# Altium schematic sheet Statron_RP2040.SchDoc
size A4; SheetNumber: 1; SheetTotal: 1
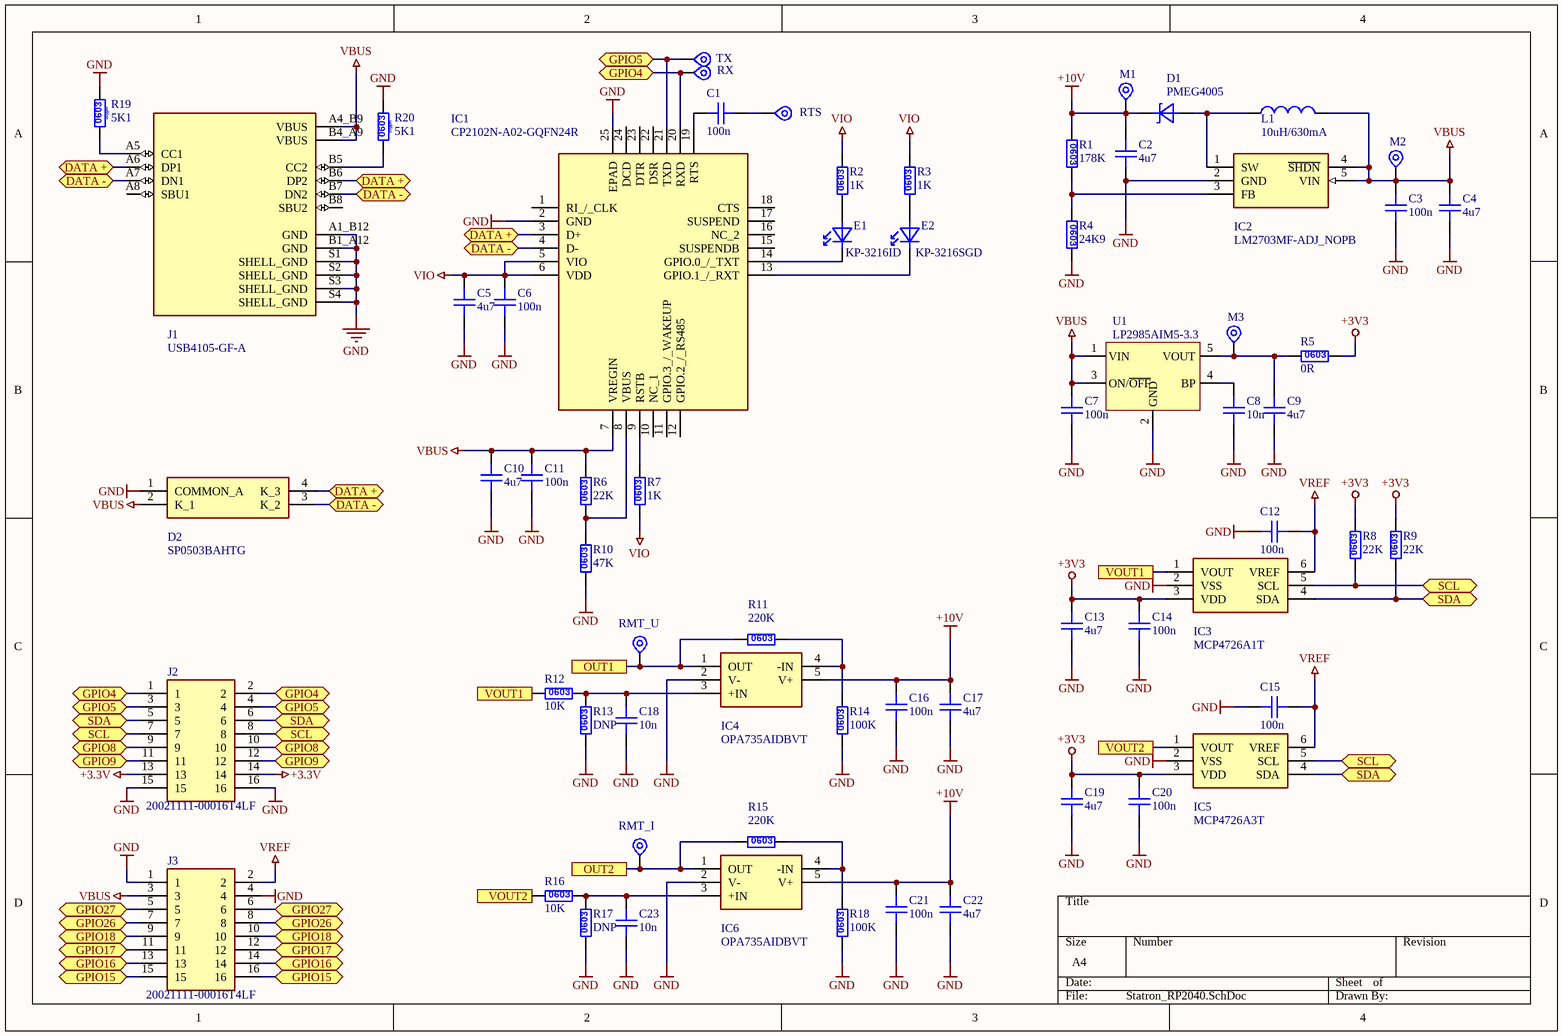
[diagram p0: Statron_RP2040.SchDoc]

## Parts
C1  100n  [C0603M]
C2  4u7  [C0603]
C3  100n  [C0603M]
C4  4u7  [C0603]
C5  4u7  [C0603]
C6  100n  [C0603M]
C7  100n  [C0603M]
C8  10n  [C0603M]
C9  4u7  [C0603]
C10  4u7  [C0603]
C11  100n  [C0603M]
C12  100n  [C0603M]
C13  4u7  [C0603]
C14  100n  [C0603M]
C15  100n  [C0603M]
C16  100n  [C0603M]
C17  4u7  [C0603]
C18  10n  [C0603M]
C19  4u7  [C0603]
C20  100n  [C0603M]
C21  100n  [C0603M]
C22  4u7  [C0603]
C23  10n  [C0603M]
D1  PMEG4005  [SOD323]
D2  SP0503BAHTG  [SP0503BAHTG]
E1  KP-3216ID  [LED1206 R]
E2  KP-3216SGD  [LED1206 G]
IC1  CP2102N-A02-GQFN24R  [QFN50P400X400X80-25N-D]
IC2  LM2703MF-ADJ_NOPB  [SOT95P280X145-5N]
IC3  MCP4726A1T  [SOT95P270X145-6N]
IC4  OPA735AIDBVT  [SOT95P280X145-5N]
IC5  MCP4726A3T  [SOT95P270X145-6N]
IC6  OPA735AIDBVT  [SOT95P280X145-5N]
J1  USB4105-GF-A  [GCT_USB4105-GF-A]
J2  20021111-00016T4LF  [2002111100016T4LF]
J3  20021111-00016T4LF  [2002111100016T4LF]
L1  10uH/630mA  [L_HEXAGON_2.8x2.8_H1.3_SMD_WE-TPC_2813]
M1  TP  [Pad 1mm SMD]  (value not drawn)  (no BOM)
M2  TP  [Pad 1mm SMD]  (value not drawn)  (no BOM)
M3  TP  [Pad 1mm SMD]  (value not drawn)  (no BOM)
R1  178K  [R0603]
R2  1K  [R0603]
R3  1K  [R0603]
R4  24K9  [R0603]
R5  0R  [R0603]
R6  22K  [R0603]
R7  1K  [R0603]
R8  22K  [R0603]
R9  22K  [R0603]
R10  47K  [R0603]
R11  220K  [R0603]
R12  10K  [R0603]
R13  DNP  [R0603]
R14  100K  [R0603]
R15  220K  [R0603]
R16  10K  [R0603]
R17  DNP  [R0603]
R18  100K  [R0603]
R19  5K1  [R0603]
R20  5K1  [R0603]
RMT_I  TP  [Pad0.6mm]  (value not drawn)  (no BOM)
RMT_U  TP  [Pad0.6mm]  (value not drawn)  (no BOM)
RTS  TP  [Pad0.6mm]  (value not drawn)  (no BOM)
RX  TP  [Pad0.6mm]  (value not drawn)  (no BOM)
TX  TP  [Pad0.6mm]  (value not drawn)  (no BOM)
U1  LP2985AIM5-3.3  [SOT23-5]

## Ports
DATA + (bidir), DATA - (bidir), GPIO4 (bidir), GPIO5 (bidir), GPIO8 (bidir), GPIO9 (bidir), GPIO15 (bidir), GPIO16 (bidir), GPIO17 (bidir), GPIO18 (bidir), GPIO26 (bidir), GPIO27 (bidir), OUT1, OUT2, SCL (bidir), SDA (bidir), VOUT1, VOUT2

## Nets
+3.3V: J2.13 J2.14
+3V3: C13.2 C14.2 C19.2 C20.2 IC3.3(VDD) IC5.3(VDD) R5.1 R8.1 R9.1
+10V: C2.2 C16.1 C17.2 C21.1 C22.2 D1.2(C) IC4.5(V+) IC6.5(V+) M1.1 R1.2
GND: C2.1 C3.2 C4.2 C5.2 C6.2 C7.2 C8.2 C9.2 C10.2 C11.2 C12.2 C13.1 C14.1 C15.2 C16.2 C17.1 C18.2 C19.1 C20.1 C21.2 C22.1 C23.2 D2.1(COMMON_A) IC1.2(GND) IC1.25(EPAD) IC2.2(GND) IC3.2(VSS) IC4.2(V-) IC5.2(VSS) IC6.2(V-) J1.A1_B12(GND) J1.B1_A12(GND) J1.S1(SHELL_GND) J1.S2(SHELL_GND) J1.S3(SHELL_GND) J1.S4(SHELL_GND) J2.15 J2.16 J3.1 J3.4 R4.1 R10.2 R13.2 R14.2 R17.2 R18.2 R19.1 R20.1 U1.2(GND)
VBUS: C3.1 C4.1 C7.1 C10.1 C11.1 D2.2(K_1) IC1.7(VREGIN) IC2.4(~{SHDN}) IC2.5(VIN) J1.A4_B9(VBUS) J1.B4_A9(VBUS) J3.3 L1.2 M2.1 R6.1 U1.1(VIN) U1.3(ON/~{OFF})
VIO: C5.1 C6.1 IC1.5(VIO) IC1.6(VDD) R2.1 R3.1 R7.2
VREF: C12.1 C15.1 IC3.6(VREF) IC5.6(VREF) J3.2
DATA +: D2.4(K_3) IC1.3(D+) J1.A6(DP1) J1.B6(DP2) ; port DATA +
DATA -: D2.3(K_2) IC1.4(D-) J1.A7(DN1) J1.B7(DN2) ; port DATA -
GPIO4: IC1.20(RXD) J2.1 J2.2 RX.1 ; port GPIO4
GPIO5: IC1.21(TXD) J2.3 J2.4 TX.1 ; port GPIO5
GPIO8: J2.9 J2.10 ; port GPIO8
GPIO9: J2.11 J2.12 ; port GPIO9
GPIO15: J3.15 J3.16 ; port GPIO15
GPIO16: J3.13 J3.14 ; port GPIO16
GPIO17: J3.11 J3.12 ; port GPIO17
GPIO18: J3.9 J3.10 ; port GPIO18
GPIO26: J3.7 J3.8 ; port GPIO26
GPIO27: J3.5 J3.6 ; port GPIO27
OUT1: IC4.1(OUT) R11.2 RMT_U.1 ; port OUT1
OUT2: IC6.1(OUT) R15.2 RMT_I.1 ; port OUT2
SCL: IC3.5(SCL) IC5.5(SCL) J2.7 J2.8 R8.2 ; port SCL
SDA: IC3.4(SDA) IC5.4(SDA) J2.5 J2.6 R9.2 ; port SDA
VOUT1: IC3.1(VOUT) R12.2 ; port VOUT1
VOUT2: IC5.1(VOUT) R16.2 ; port VOUT2
NetC1_1: C1.1 RTS.1
NetC1_2: C1.2 IC1.19(RTS)
NetC8_1: C8.1 U1.4(BP)
NetC9_1: C9.1 M3.1 R5.2 U1.5(VOUT)
NetC18_1: C18.1 IC4.3(+IN) R12.1 R13.1
NetC23_1: C23.1 IC6.3(+IN) R16.1 R17.1
NetD1_1: D1.1(A) IC2.1(SW) L1.1
NetE1_1: E1.1(A) R2.2
NetE1_2: E1.2(C) IC1.14(GPIO.0_/_TXT)
NetE2_1: E2.1(A) R3.2
NetE2_2: E2.2(C) IC1.13(GPIO.1_/_RXT)
NetIC1_8: IC1.8(VBUS) R6.2 R10.1
NetIC1_9: IC1.9(RSTB) R7.1
NetIC2_3: IC2.3(FB) R1.1 R4.2
NetIC4_4: IC4.4(-IN) R11.1 R14.1
NetIC6_4: IC6.4(-IN) R15.1 R18.1
NetJ1_A5: J1.A5(CC1) R19.2
NetJ1_B5: J1.B5(CC2) R20.2

Not connected (* = marked no-connect by the designer): IC1 1(RI_/_CLK) 10(NC_1) 11(GPIO.3_/_WAKEUP) 12(GPIO.2_/_RS485) 15(SUSPENDB) 16(NC_2) 17(SUSPEND) 18(CTS) 22(DSR) 23(DTR) 24(DCD); J1 A8(SBU1) B8(SBU2)

## Notes on the sheet
- (in symbol CMP-UN-001948-2) 50ppm; 0603
- (in symbol CMP-UN-001953-2) 0603
- (in symbol CMP-UN-001963-2) 0603
- (in symbol CMP-UN-001972-2) 0603
- (in symbol CMP-UN-001976-2) 0603
- (in symbol CMP-UN-001981-2) 0603
- (in symbol CMP-UN-002024-2) 0603
- (in symbol CMP-UN-002043-2) 0603

## Library data of the parts
C1 C3 C6 C11 C12 C14-C16 C20 C21 = CMP-UN-000268-1: Ceramic Capacitor X7R; Manufacturer: VISHAY; Part Number: 100n/16V X7R C0603; Main: Capacitors; SMD/THD: SMD; Value: 100n/16V; Stock number: 10003450; Category: Capacitors CERA SMD; Status: X; Manufacturer Part Number: 100n/16V X7R C0603; Component Type: Capacitors
C2 C4 C5 C9 C10 C13 C17 C19 C22 = CMP-UN-000401-1: Ceramic Capacitor X5R; Part Number: GRM188R60J475KE19J; Manufacturer: Murata; Value: 4u7/6,3V; SMD/THD: SMD; Main: Capacitors; Category: Capacitors CERA SMD; Stock number: 10006168; Status: T; ComponentLink1URL: http://datasheet.octopart.com/GRM188R60J475KE19J-Murata-datasheet-14401031.pdf; ComponentLink1Description: Datasheet; Manufacturer Part Number: GRM188R60J475KE19J; Component Type: Capacitors
C7 = UniversalCapacitor: Ceramic Capacitor X7R; Manufacturer: VISHAY; Part Number: 100n/16V X7R C0603; Main: Capacitors; SMD/THD: SMD; Value: 100n/16V; Stock number: 10003450; Category: Capacitors CERA SMD; Status: X
C8 C18 C23 = UniversalCapacitor: Ceramic Capacitor X7R; Manufacturer: VISHAY; Part Number: 10n/50V X7R C0603; SMD/THD: SMD; Main: Capacitors; Status: A; Stock number: 10002497; Category: Capacitors CERA SMD; Value: 10n
D1 = CMP-UN-000984-1: Schottky Diode 40V, 500mA; Part Number: PMEG4005AEA; Manufacturer: NXP; SMD/THD: SMD; Main: Diodes; ComponentLink1URL: http://www.farnell.com/datasheets/684565.pdf; Value: PMEG4005; ComponentLink1Description: Datasheet; Category: Schottky; Status: A; Stock number: 10004763
D2 = SP0503BAHTG: TVS Diode (Uni-directional); Manufacturer_Name: LITTELFUSE; Height: 1.22mm; Manufacturer_Part_Number: SP0503BAHTG
E1 = CMP-UN-001017-1: SMD LED Red; Manufacturer: KINGBRIGHT; Main: Diodes; ComponentLink1Description: Datasheet; Category: LED; ComponentLink1URL: http://www.tme.eu/en/details/kp-3216id/smd-leds-1206/kingbright-electronic/; Status: A; Part Number: KP-3216ID; Stock number: 10005421; SMD/THD: SMD; Value: Red
E2 = CMP-UN-001018-1: SMD LED Green; Manufacturer: KINGBRIGHT; Main: Diodes; Status: A; Value: Green; Part Number: KP-3216SGD; Category: LED; ComponentLink1URL: http://www.tme.eu/en/details/kp-3216sgd/smd-leds-1206/kingbright-electronic/; ComponentLink1Description: Datasheet; SMD/THD: SMD; Stock number: 10005422
IC1 = CP2102N-A02-GQFN24R: Integrated Circuit; Manufacturer_Name: Silicon Labs; Datasheet Link: https://componentsearchengine.com//CP2102N-A02-GQFN24R.pdf; Height: 0.8mm; Mouser2 Part Number: 634-CP2102NA02QFN24R; Mouser2 Price/Stock: https://www.mouser.com/Search/Refine.aspx?Keyword=634-CP2102NA02QFN24R; Manufacturer_Part_Number: CP2102N-A02-GQFN24R
IC2 = LM2703MF-ADJ_NOPB: Integrated Circuit; Manufacturer_Name: Texas Instruments; Manufacturer_Part_Number: LM2703MF-ADJ/NOPB; Datasheet Link: https://datasheet.datasheetarchive.com/originals/distributors/Datasheets-SFU2/DSASFU100036636.pdf; Height: 1.45mm
IC3 IC5 = MCP4726A3T-E_CH: Integrated Circuit; Manufacturer_Name: Microchip; Manufacturer_Part_Number: MCP4726A3T-E/CH; Datasheet Link: https://componentsearchengine.com//MCP4726A3T-E_CH.pdf; Height: 1.45mm; Mouser2 Part Number: 579-MCP4726A3TECH; Mouser2 Price/Stock: https://www.mouser.com/Search/Refine.aspx?Keyword=579-MCP4726A3TECH
IC4 IC6 = OPA735AIDBVT: Integrated Circuit; Manufacturer_Name: Texas Instruments; Datasheet Link: http://www.ti.com/lit/gpn/opa735; Height: 1.45mm; Mouser2 Part Number: 595-OPA735AIDBVT; Mouser2 Price/Stock: https://www.mouser.com/Search/Refine.aspx?Keyword=595-OPA735AIDBVT; Manufacturer_Part_Number: OPA735AIDBVT
J1 = USB4105-GF-A: USB-C (USB TYPE-C) USB 2.0 Receptacle Connector 24 (16+8 Dummy) Position Surface Mount, Right Angle; Through Hole; MF: GCT; Price: None; Value: *; MP: USB4105-GF-A; Package: None; Purchase-URL: https://pricing.snapeda.com/search/part/USB4105-GF-A/?ref=eda; SnapEDA_Link: https://www.snapeda.com/parts/USB4105-GF-A/Global%20Connector%20Technology/view-part/4423780/?ref=snap; Check_prices: https://www.snapeda.com/parts/USB4105-GF-A/Global%20Connector%20Technology/view-part/4423780/?ref=eda; Availability: Warning
J2 J3 = 20021111-00016T4LF: Connector; Manufacturer_Name: Amphenol; Datasheet Link: https://cdn.amphenol-icc.com/media/wysiwyg/files/drawing/20021111.pdf; Height: 5.5mm; Manufacturer_Part_Number: 20021111-00016T4LF
L1 = CMP-UN-002654-1: SMT power inductor WE-TPC_2813; Manufacturer: Würt Elektronik; Part Number: 744029100; Main: Inductors; ComponentLink1Description: Datasheet; Category: Inductors; Value: 10uH/630mA; ComponentLink1URL: http://datasheet.octopart.com/744029100-W%C3%BCrth-Elektronik-datasheet-41342342.pdf
M1-M3 = M Point: Test Point; Main: Mechanical; Category: Pads_Pins_Measure_Points; Stock number: --------
R1 = CMP-UN-002024-2: Resistor 1%, 0.1W, 75V; Part Number: 180K R0603; Manufacturer: VISHAY; SMD/THD: SMD; Main: Resistors; Value: 178K; Category: Resistors SMD; Status: T; Stock number: 10005169
R2 R3 R7 = CMP-UN-001963-2: Resistor 1%, 0.1W, 75V; Manufacturer: Vishay Dale; Part Number: 1K R0603; Manufacturer Part Number: CRCW06031K00FKEA; SMD/THD: SMD; Main: Resistors; Value: 1K; Status: A; Category: Resistors SMD; Stock number: 10004641; Component Type: Resistors
R4 = CMP-UN-001976-2: Resistor 1%, 0.1W, 75V; Part Number: 27K R0603; Manufacturer: VISHAY; Main: Resistors; SMD/THD: SMD; Stock number: 10004689; Category: Resistors SMD; Status: A; Value: 24K9
R5 = CMP-UN-002043-2: Resistor 1%, 0.1W, 75V; Part Number: 0R R0603; Manufacturer: VISHAY; SMD/THD: SMD; Main: Resistors; Stock number: 10005433; Value: 0R; Category: Resistors SMD; Status: A
R6 R8 R9 R11 R15 = CMP-UN-001981-2: Resistor 1%, 0.1W, 75V; Part Number: 22K R0603; Manufacturer: VISHAY; Main: Resistors; SMD/THD: SMD; Category: Resistors SMD; Stock number: 10004787; Status: A
  R6 R8 R9: Value: 22K
  R11 R15: Value: 220K
R10 = CMP-UN-001972-2: Resistor 1%, 0.1W, 75V; Manufacturer: VISHAY; Part Number: 47K R0603; SMD/THD: SMD; Main: Resistors; Category: Resistors SMD; Status: A; Value: 47K; Stock number: 10004685
R12-R14 R16-R18 = CMP-UN-001953-2: Resistor 1%, 0.1W, 75V; Part Number: 10K R0603; Manufacturer: Vishay Semiconductors; Manufacturer Part Number: CRCW060310K0FKEAC; Main: Resistors; SMD/THD: SMD; Stock number: 10004622; Category: Resistors SMD; Status: A; Component Type: Resistors
  R12 R16: Value: 10K
  R13 R17: Value: DNP
  R14 R18: Value: 100K
R19 R20 = CMP-UN-001948-2: Resistor 1%, 0.1W, 75V, 50ppm; Manufacturer: Vishay; Part Number: CRCW060356K0FHEAP; SMD/THD: SMD; Main: Resistors; ComponentLink1URL: http://www.vishay.com/docs/20036/dcrcwpe3.pdf; Stock number: 10004617; Status: A; Value: 5K1; Category: Resistors SMD; ComponentLink1Description: Datasheet
RMT_I RMT_U RTS RX TX = CMP-UN-002500-5: Test Point; Main: Mechanical; Category: Pads_Pins_Measure_Points; Stock number: --------; Component Type: Mechanical
U1 = LP2985_SOT25: 150-mA , Low-Dropout Regulator; Manufacturer: Texas Instruments; Part Number: LP2985AIM5-3.3/NOPB; SMD/THD: SMD; Main: IC's; Value: LP2985AIM5-3.3; Category: Voltage Regulators; Stock number: 10006099; ComponentLink1Description: Datasheet; Status: N; ComponentLink1URL: http://www.farnell.com/datasheets/1972829.pdf